# EAGLE design mainboardV1.1 (EAGLE 9.6.2)
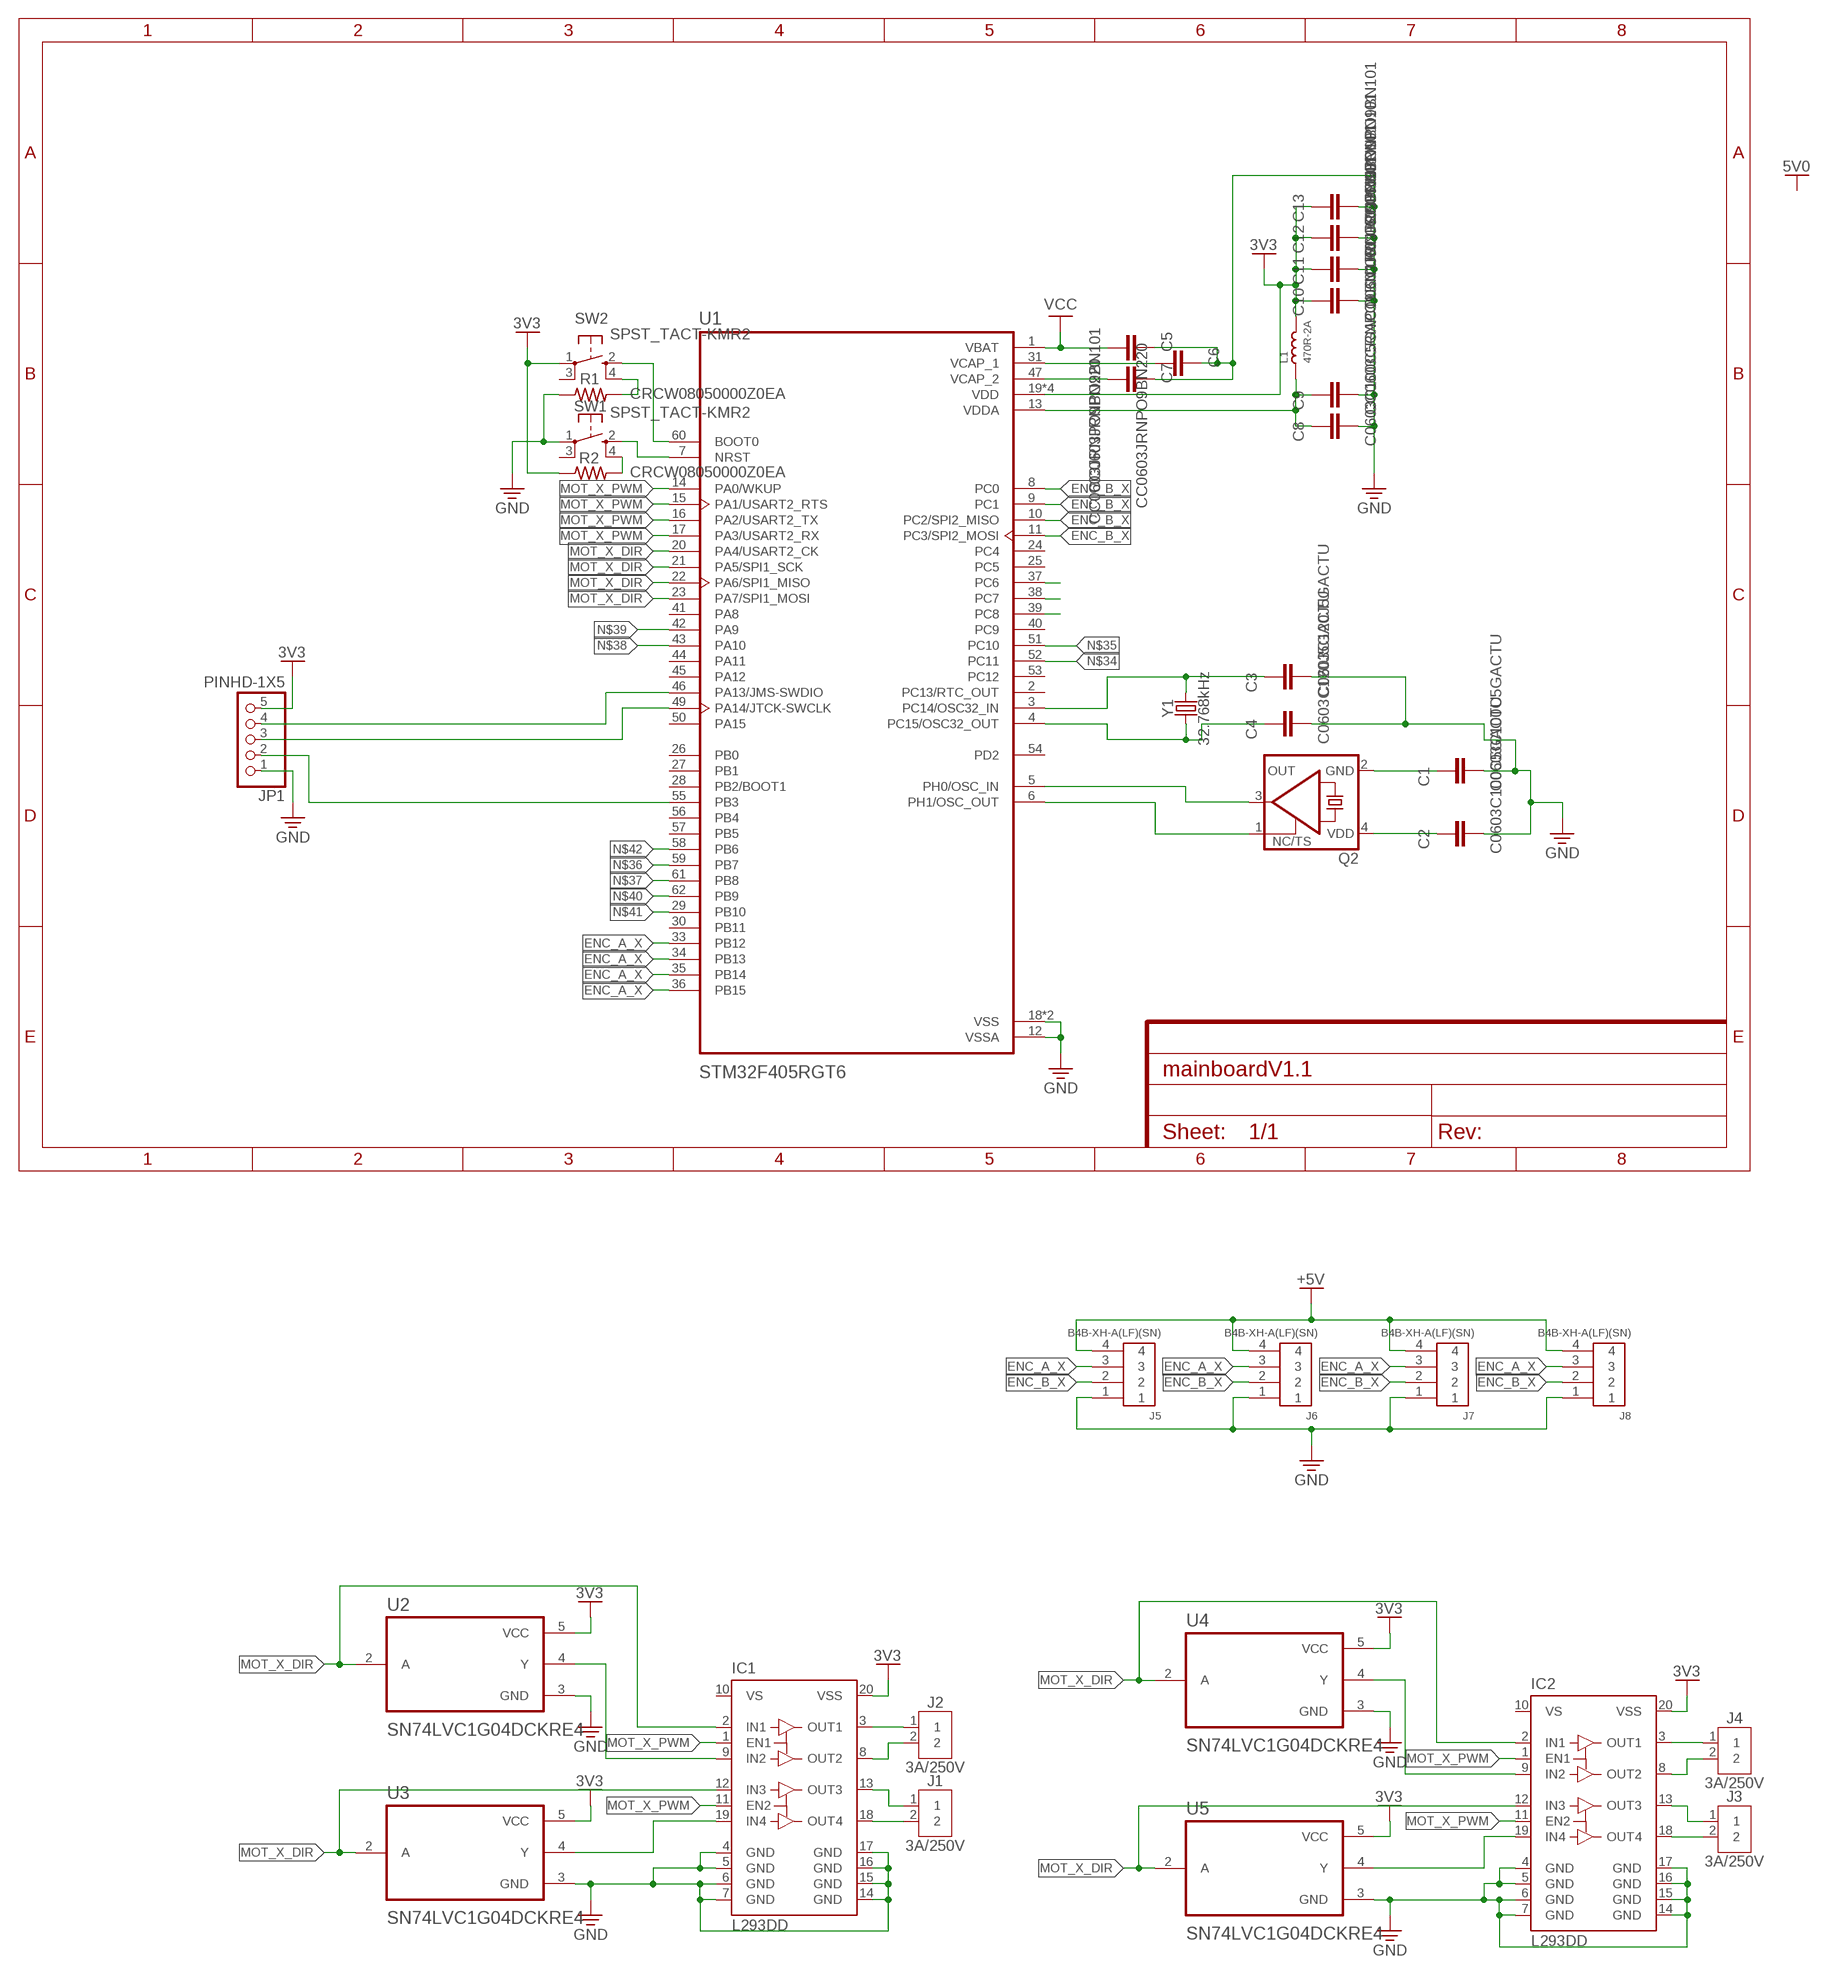
[diagram p0: schematic, sheet 1]

## Parts
C1  C0603C100C5GACTU  [CAP_0603]
C2  C0603C100C5GACTU  [CAP_0603]
C3  C0603C120J5GACTU  [CAP_0603]
C4  C0603C120J5GACTU  [CAP_0603]
C5  CC0603JRNPO9BN101  [CAP_0603]
C6  CC0603JRNPO9BN220  [CAP_0603]
C7  CC0603JRNPO9BN220  [CAP_0603]
C8  C0603C100C5GACTU  [CAP_0603]
C9  CC0603CRNPO9BN1R0  [CAP_0603]
C10  CC0603JRNPO9BN101  [CAP_0603]
C11  CC0603JRNPO9BN101  [CAP_0603]
C12  CC0603JRNPO9BN101  [CAP_0603]
C13  CC0603JRNPO9BN101  [CAP_0603]
IC1  L293DD  [SO20]
IC2  L293DD  [SO20]
J1  3A/250V  B2B-XH-A  [B2B-XH-A]
J2  3A/250V  B2B-XH-A  [B2B-XH-A]
J3  3A/250V  B2B-XH-A  [B2B-XH-A]
J4  3A/250V  B2B-XH-A  [B2B-XH-A]
J5  B4B-XH-A(LF)(SN)  [B4B-XH-A(LF)(SN)]
J6  B4B-XH-A(LF)(SN)  [B4B-XH-A(LF)(SN)]
J7  B4B-XH-A(LF)(SN)  [B4B-XH-A(LF)(SN)]
J8  B4B-XH-A(LF)(SN)  [B4B-XH-A(LF)(SN)]
JP1  PINHD-1X5  [1X05]
L1  470R-2A  SMD-FERRITE-BEAD-470R-2A(0805)'0805'  [L0805]
Q2  KXO-PXO/XO-V96  [3.2X2.5_KXO-V96]
R1  CRCW08050000Z0EA  [RES_0805]
R2  CRCW08050000Z0EA  [RES_0805]
SW1  SPST_TACT-KMR2  [KMR2]
SW2  SPST_TACT-KMR2  [KMR2]
U1  STM32F405RGT6  [QFP50P1200X1200X160-64N]
U2  SN74LVC1G04DCKRE4  [SOT65P210X110-5N]
U3  SN74LVC1G04DCKRE4  [SOT65P210X110-5N]
U4  SN74LVC1G04DCKRE4  [SOT65P210X110-5N]
U5  SN74LVC1G04DCKRE4  [SOT65P210X110-5N]
Y1  32.768kHz  CRYSTAL-32.768KHZSMD-3.2X1.5  [CRYSTAL-SMD-3.2X1.5MM]

## Nets
3V3: C10.1 C11.1 C12.1 C13.1 IC1.20(VSS) IC2.20(VSS) JP1.5 L1.2 R2.1 SW2.1(P) U1.19(VDD) U1.32(VDD) U1.48(VDD) U1.64(VDD) U2.5(VCC) U3.5(VCC) U4.5(VCC) U5.5(VCC)
+5V: J5.4 J6.4 J7.4 J8.4
ENC_A_X: J5.3 J6.3 J7.3 J8.3 U1.33(PB12) U1.34(PB13) U1.35(PB14) U1.36(PB15)
ENC_B_X: J5.2 J6.2 J7.2 J8.2 U1.8(PC0) U1.9(PC1) U1.10(PC2/SPI2_MISO) U1.11(PC3/SPI2_MOSI)
GND: C1.2 C2.2 C3.2 C4.2 C5.1 C6.1 C7.1 C8.2 C9.2 C10.2 C11.2 C12.2 C13.2 IC1.4(GND) IC1.5(GND) IC1.6(GND) IC1.7(GND) IC1.14(GND) IC1.15(GND) IC1.16(GND) IC1.17(GND) IC2.4(GND) IC2.5(GND) IC2.6(GND) IC2.7(GND) IC2.14(GND) IC2.15(GND) IC2.16(GND) IC2.17(GND) J5.1 J6.1 J7.1 J8.1 JP1.1 R1.1 SW1.1(P) U1.12(VSSA) U1.18(VSS) U1.63(VSS) U2.3(GND) U3.3(GND) U4.3(GND) U5.3(GND)
MOT_X_DIR: IC1.2(IN1) IC1.12(IN3) IC2.2(IN1) IC2.12(IN3) U1.20(PA4/USART2_CK) U1.21(PA5/SPI1_SCK) U1.22(PA6/SPI1_MISO) U1.23(PA7/SPI1_MOSI) U2.2(A) U3.2(A) U4.2(A) U5.2(A)
MOT_X_PWM: IC1.1(EN1) IC1.11(EN2) IC2.1(EN1) IC2.11(EN2) U1.14(PA0/WKUP) U1.15(PA1/USART2_RTS) U1.16(PA2/USART2_TX) U1.17(PA3/USART2_RX)
N$1: Q2.3(OUT) U1.5(PH0/OSC_IN)
N$2: Q2.1(TS) U1.6(PH1/OSC_OUT)
N$3: C4.1 U1.4(PC15/OSC32_OUT) Y1.P$1
N$4: U1.37(PC6)
N$5: JP1.4 U1.46(PA13/JMS-SWDIO)
N$6: JP1.3 U1.49(PA14/JTCK-SWCLK)
N$7: JP1.2 U1.55(PB3)
N$8: IC1.19(IN4) U3.4(Y)
N$9: C6.2 U1.31(VCAP_1)
N$10: C8.1 C9.1 L1.1 U1.13(VDDA)
N$11: SW2.2(S) U1.60(BOOT0)
N$12: SW1.2(S) U1.7(NRST)
N$13: C7.2 U1.47(VCAP_2)
N$14: R1.2 SW2.4(S1)
N$15: R2.2 SW1.4(S1)
N$16: C3.1 U1.3(PC14/OSC32_IN) Y1.P$2
N$17: C1.1 Q2.2(GND)
N$18: C2.1 Q2.4(VDD)
N$19: IC1.9(IN2) U2.4(Y)
N$20: U1.38(PC7)
N$21: U1.39(PC8)
N$34: U1.52(PC11)
N$35: U1.51(PC10)
N$36: U1.59(PB7)
N$37: U1.61(PB8)
N$38: U1.43(PA10)
N$39: U1.42(PA9)
N$40: U1.62(PB9)
N$41: U1.29(PB10)
N$42: U1.58(PB6)
N$44: IC1.13(OUT3) J1.1
N$45: IC1.18(OUT4) J1.2
N$46: IC1.8(OUT2) J2.2
N$47: IC1.3(OUT1) J2.1
N$49: IC2.19(IN4) U5.4(Y)
N$50: IC2.9(IN2) U4.4(Y)
N$54: IC2.13(OUT3) J3.1
N$55: IC2.18(OUT4) J3.2
N$56: IC2.8(OUT2) J4.2
N$57: IC2.3(OUT1) J4.1
VCC: C5.2 U1.1(VBAT)
Unconnected: SW1.3(P1) SW2.3(P1) U1.2(PC13/RTC_OUT) U1.24(PC4) U1.25(PC5) U1.26(PB0) U1.27(PB1) U1.28(PB2/BOOT1) U1.30(PB11) U1.40(PC9) U1.41(PA8) U1.44(PA11) U1.45(PA12) U1.50(PA15) U1.53(PC12) U1.54(PD2) U1.56(PB4) U1.57(PB5)

## Power pins joined to a net without a drawn wire
VS: IC1.10(VS) IC2.10(VS)

## Library data of the parts
C1 C2 C8 = Resistor_Capacitor:C0603C100C5GACTU: CAP CER 10PF 50V C0G/NP0 0603 Manufacturer's datasheet <https://content.kemet.com/datasheets/KEM_C1003_C0G_SMD.pdf>; CREATED_BY: PCBLayout.com; DIGIKEY_PART_NUMBER: 399-7814-2-ND; MANUFACTURER: KEMET; MPN: C0603C100C5GACTU; PACKAGE: SMD 0603
C3 C4 = Resistor_Capacitor:C0603C120J5GACTU: CAP CER 12PF 50V C0G/NP0 0603 Manufacturer's datasheet <https://content.kemet.com/datasheets/KEM_C1003_C0G_SMD.pdf>; CREATED_BY: PCBLayout.com; DIGIKEY_PART_NUMBER: 399-1050-2-ND; MANUFACTURER: KEMET; MPN: C0603C120J5GACTU; PACKAGE: SMD 0603
C5 C10-C13 = Resistor_Capacitor:CC0603JRNPO9BN101: CAP CER 100PF 50V C0G/NPO 0603 Manufacturer's datasheet <http://www.yageo.com/documents/recent/UPY-GP_NP0_16V-to-50V_16.pdf>; CREATED_BY: PCBLayout.com; DIGIKEY_PART_NUMBER: 311-1069-2-ND; MANUFACTURER: Yageo; MPN: CC0603JRNPO9BN101; PACKAGE: SMD 0603
C6 C7 = Resistor_Capacitor:CC0603JRNPO9BN220: CAP CER 22PF 50V C0G/NPO 0603 Manufacturer's datasheet <http://www.yageo.com/documents/recent/UPY-GP_NP0_16V-to-50V_16.pdf>; CREATED_BY: PCBLayout.com; DIGIKEY_PART_NUMBER: 311-1062-2-ND; MANUFACTURER: Yageo; MPN: CC0603JRNPO9BN220; PACKAGE: SMD 0603
C9 = Resistor_Capacitor:CC0603CRNPO9BN1R0: CAP CER 1PF 50V C0G/NPO 0603 Manufacturer's datasheet <http://www.yageo.com/documents/recent/UPY-GP_NP0_16V-to-50V_16.pdf>; CREATED_BY: PCBLayout.com; DIGIKEY_PART_NUMBER: 311-1049-2-ND; MANUFACTURER: Yageo; MPN: CC0603CRNPO9BN1R0; PACKAGE: SMD 0603
IC1 IC2 = st-microelectronics:L293DD: PUSH-PULL FOUR CHANNEL DRIVER WITH DIODES Source: http://www.st.com/stonline/books/pdf/docs/1330.pdf; OC_FARNELL: unknown
J1-J4 = Connector:B2B-XH-A: XH Connector Top Entry - 2POS Details see: Datasheet <http://www.jst-mfg.com/product/pdf/eng/eXH.pdf>; CATEGORY: CONNECTOR; DESCRIPTION: 2.5mm pitch/disconnectable crimp style connector; MANUFACTURER: JST (XH CONNECTOR); MPN: B2B-XH-A; OPERATING_TEMPERATURE: -25°C ~ 85°C; PART_STATUS: ACTIVE; ROHS_COMPLIANT: COMPLIANT; SERIES: B_B-XH-A; SUB_CATEGORY: Through hole connector; TYPE: top entry
J5-J8 = Headers:B4B-XH-A(LF)(SN): CONN HEADER VERT 4POS 2.5MM Manufacturer's datasheet <http://www.jst-mfg.com/product/pdf/eng/eXH.pdf>; CREATED_BY: PCBLayout.com; DIGIKEY_PARTNO: 455-2249-ND; MANUFACTURER: JST Sales America Inc.; MPN: B4B-XH-A(LF)(SN)
JP1 = Connector:PINHD-1X5: PIN HEADER; CATEGORY: CONNECTOR; SUB-CATEGORY: PIN-HEADER
L1 = OPL_Ferrite_and_Magnetic_Bead:SMD-FERRITE-BEAD-470R-2A(0805): 303030008; MPN: WLB2012-471T20
Q2 = crystal-geyer_V1_0:KXO-PXO/XO-V: Clock Oscillator (PXO/XO) MHz : KXO-V - Serie Model Size l/w/h [mm] Frequency Range Frequency Stability Temp. Range [°C] Output AECQ 200 availabel Datasheet KXO-V94 KXO-V94 KXO-V95 KXO-V95 KXO-V96 KXO-V96 KXO-V99 KXO-V99 KXO-97 KXO-V97 KXO-97 - KXO-V97 2.0/1.6/0.80 2.0/1.6/0.80 2.5/2.0/0.82 2.5/2.0/0.82 3.2/2.5/1.2 3.2/2.5/1.2 5.0/3.2/1.2 5.0/3.2/1.2 7.0/5.08/1.3 7.0/5.08/1.3 7.0/5.08/1.3 32,768 kHz 1,0 ~ 80,0 MHz 32,768 kHz 1,0 ~ 70,0 MHz 32,768 kHz 1,0 ~ 156,0 MHz 32,768 kHz 1,0 ~ 200,0 MHz 32,768 kHz 32,768 kHz 1,0 ~ 160,0 MHz ±25 … ±100ppm ±25 … ±100ppm ±25 … ±100ppm ±25 … ±100ppm ±25 … ±100ppm ±25 … ±100ppm ±25 … ±100ppm ±25 … ±100ppm ±25 … ±100ppm ±25 … ±100ppm ±25 … ±100ppm (*) -40°C …+85°C (*) -40°C …+85°C (*) -40°C …+85°C (*) -40°C …+85°C (*) -40°C …+85°C (*) -40°C …+85°C (*) -40°C …+85°C (*) -40°C …+85°C (*) -40°C …+85°C (*) -40°C …+85°C (*) -40°C …+85°C HCMOS HCMOS HCMOS HCMOS HCMOS HCMOS HCMOS HCMOS HCMOS HCMOS HCMOS - - yes yes yes yes - - - - - KXO-V94-kHz.pdf <http://www.geyer-electronic.de/uploads/tx_userartikelfrequenz/GEYER-KXO-V94-kHz.pdf> KXO-V94.pdf <http://www.geyer-electronic.de/uploads/tx_userartikelfrequenz/GEYER-KXO-V94.pdf> KXO-V95-kHz.pdf <http://www.geyer-electronic.de/uploads/tx_userartikelfrequenz/GEYER-KXO-V95-kHz.pdf> KXO-V95.pdf <http://www.geyer-electronic.de/uploads/tx_userartikelfrequenz/GEYER-KXO-V95.pdf> KXO-V96-kHz.pdf <http://www.geyer-electronic.de/uploads/tx_userartikelfrequenz/GEYER-KXO-V96-kHz.pdf> KXO-V96.pdf <http://www.geyer-electronic.de/uploads/tx_userartikelfrequenz/GEYER-KXO-V96.pdf> KXO-V99-kHz.pdf <http://www.geyer-electronic.de/uploads/tx_userartikelfrequenz/GEYER-KXO-V99-kHz.pdf> KXO-V99.pdf <http://www.geyer-electronic.de/uploads/tx_userartikelfrequenz/GEYER-KXO-V99.pdf> KXO-97-kHz.pdf <http://www.geyer-electronic.de/uploads/tx_userartikelfrequenz/GEYER-KXO-97-kHz.pdf> KXO-V97-kHz.pdf <http://www.geyer-electronic.de/uploads/tx_userartikelfrequenz/GEYER-KXO-V97-kHz.pdf> KXO-V97.pdf <http://www.geyer-electronic.de/uploads/tx_userartikelfrequenz/GEYER-KXO-V97.pdf> <http://www.geyer-electronic.de/fileadmin/template/img/logo-geyer-electronic.png> Details see: http://www.geyer-electronic.de/Frequenz-Produkte.9.0.html Created 2016-06-07, Hans Locher 2016 (C) Geyer Quartz Technology Hans Locher KXOV94,KXOV95;KXOV96;KXOV97;KXO97;2016;2520;3225;5032;70508;2,5x2,0;3,2x2,5;5,0x3,2;7,0x5,08;2.5x2.0;3.2x2.5;5.0x3.2;7.0x5.08;
R1 R2 = Resistor_Capacitor:CRCW08050000Z0EA: RES SMD 0 OHM JUMPER 1/8W 0805 Manufacturer's datasheet <http://www.vishay.com/docs/20035/dcrcwe3.pdf>; CREATED_BY: PCBLayout.com; DIGIKEY_PART_NUMBER: 541-0.0ATR-ND; MANUFACTURER: Vishay Dale; MPN: CRCW08050000Z0EA; PACKAGE: SMD 0805
SW1 SW2 = adafruit:SPST_TACT: SMT 6mm switch, EVQQ2 series http://www.ladyada.net/library/eagle
U1 = STM32F405RGT6:STM32F405RGT6: High-performance foundation line, ARM Cortex-M4 core with DSP and FPU, 1 Mbyte Flash, 168 MHz CPU, ART Accelerator Check availability <https://pricing.snapeda.com/parts/STM32F405RGT6/STMicroelectronics/view-part?ref=eda>; AVAILABILITY: In Stock; CHECK_PRICES: https://www.snapeda.com/parts/STM32F405RGT6/STMicroelectronics/view-part/?ref=eda; DESCRIPTION: ARM® Cortex®-M4 STM32F4 Microcontroller IC 32-Bit Single-Core 168MHz 1MB (1M x 8) FLASH 64-LQFP (10x10); MF: STMicroelectronics; MP: STM32F405RGT6; PACKAGE: LQFP-64 STMicroelectronics; PRICE: None; PURCHASE-URL: https://www.snapeda.com/api/url_track_click_mouser/?unipart_id=105502&manufacturer=STMicroelectronics&part_name=STM32F405RGT6&search_term=stm32f405rgt6; SNAPEDA_LINK: https://www.snapeda.com/parts/STM32F405RGT6/STMicroelectronics/view-part/?ref=snap
U2-U5 = SN74LVC1G04DCKRE4:SN74LVC1G04DCKRE4: Check availability <https://pricing.snapeda.com/parts/SN74LVC1G04DCKRE4/Texas%20Instruments/view-part?ref=eda>; AVAILABILITY: In Stock; CHECK_PRICES: https://www.snapeda.com/parts/SN74LVC1G04DCKRE4/Texas+Instruments/view-part/?ref=eda; DESCRIPTION: Single Inverter 5-SC70 -40 to 125; MF: Texas Instruments; MP: SN74LVC1G04DCKRE4; PACKAGE: SC70-5 Texas Instruments; PRICE: None; PURCHASE-URL: https://www.snapeda.com/api/url_track_click_mouser/?unipart_id=1206589&manufacturer=Texas Instruments&part_name=SN74LVC1G04DCKRE4&search_term=sn74lvc1g04dckr; SNAPEDA_LINK: https://www.snapeda.com/parts/SN74LVC1G04DCKRE4/Texas+Instruments/view-part/?ref=snap
Y1 = SparkFun-Clocks:CRYSTAL-32.768KHZ: 32.768kHz Crystal Frequency: 32.768kHz Frequency Stability: ±20ppm Load Capacitance: 12.5pF (PTH-2X6 & SMD-3.2X1.5), 6pF (SMD-2X6) SparkFun Products: SparkFun BigTime Watch Kit <https://www.sparkfun.com/products/11734> SparkFun nRF52832 Breakout <https://www.sparkfun.com/products/13990> SparkFun Real Time Clock Module <https://www.sparkfun.com/products/12708>; PROD_ID: XTAL-13062

## Board
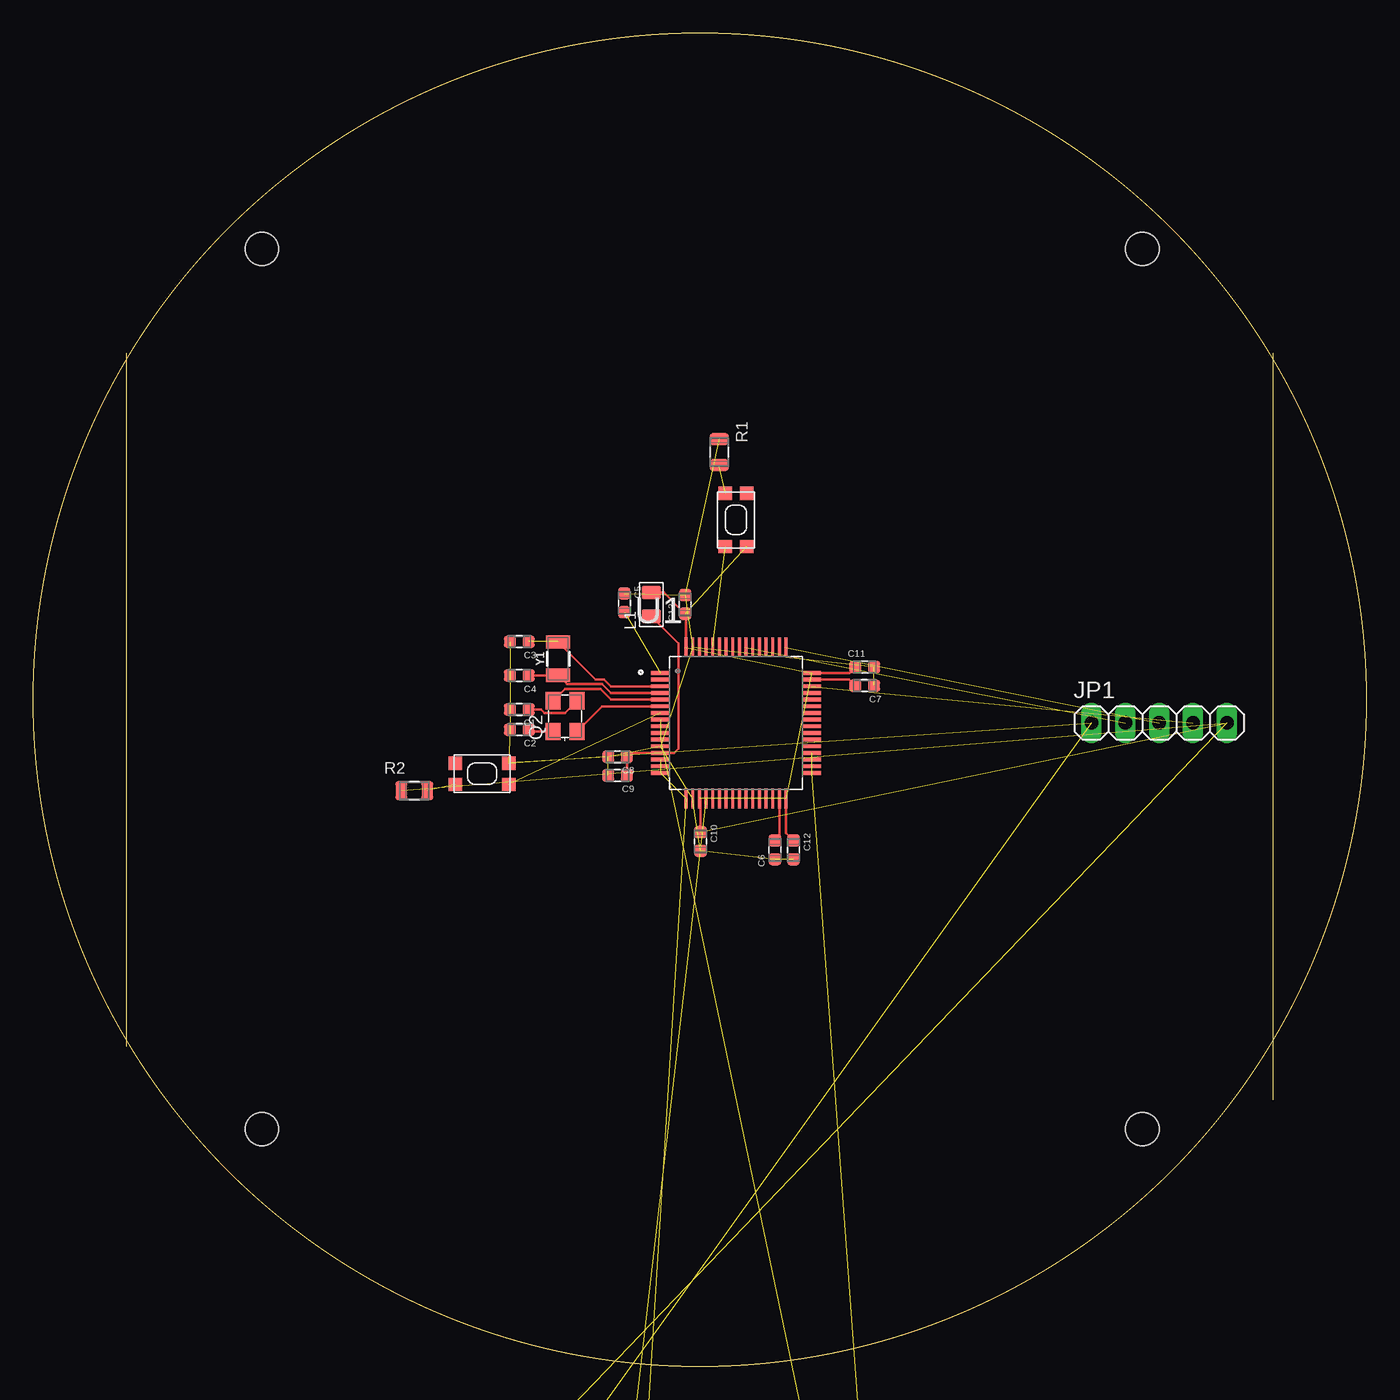
[diagram p1: board, top side]

Size 100 x 100 mm. Coordinates in mm from the lower left corner, seen from the top.
Outline: 7,24 7,76
Outline: 93,76 93,20
Outline: circle at 50,50 radius 50
Copper layers (1*16): Top 0.035mm / dielectric 1.5mm / Bottom 0.035mm
Design rules "default": minimum track width 6mil, minimum drill 0.35mm, track to track 6mil, track to pad 6mil, pad to pad 6mil, via to via 6mil, smd to smd 6mil, copper to edge 40mil, drill to drill 6mil, minimum pad ring 10mil, minimum via ring 8mil, stop-mask expansion 4mil, vias tented up to drill 0mil, thermal gap 10mil
Holes 2.5 mm at 17.16,17.78 83.2,17.78 83.2,83.82 17.16,83.82

### Footprints (pad centres in the part's own frame; a part is rotated, then mirrored left to right if it is on the bottom)
CAP_0603 = smd 0.92 x 0.93: 1 -0.705,0; 2 0.705,0
SO20 = smd 0.6 x 2.2: 1 -5.715,-4.6; 2 -4.445,-4.6; 3 -3.175,-4.6; 4 -1.905,-4.6; 5 -0.635,-4.6; 6 0.635,-4.6; 7 1.905,-4.6; 8 3.175,-4.6; 9 4.445,-4.6; 10 5.715,-4.6; 11 5.715,4.6; 12 4.445,4.6; 13 3.175,4.6; 14 1.905,4.6; 15 0.635,4.6; 16 -0.635,4.6; 17 -1.905,4.6; 18 -3.175,4.6; 19 -4.445,4.6; 20 -5.715,4.6
B2B-XH-A = drill 0.64: 1 0,0; 2 2.5,0
B4B-XH-A(LF)(SN) = drill 0.9 square: 1 -3.75,0 | drill 0.9: 2 -1.25,0; 3 1.25,0; 4 3.75,0
1X05 = drill 1.016 long: 1 -5.08,0; 2 -2.54,0; 3 0,0; 4 2.54,0; 5 5.08,0
L0805 = smd 1.016 x 1.397: 1 -0.889,0; 2 0.889,0
3.2X2.5_KXO-V96 = smd 1.3 x 1.1: 1 -1.15,-0.9; 2 1.15,-0.9; 3 1.15,0.9; 4 -1.15,0.9
RES_0805 = smd 0.87 x 1.42: 1 -0.975,0; 2 0.975,0
KMR2 = smd 1 x 1: 1 2,0.8; 2 2,-0.8; 3 -2,0.8; 4 -2,-0.8
QFP50P1200X1200X160-64N = smd 1.47 x 0.28: 1 -5.67,3.75; 2 -5.67,3.25; 3 -5.67,2.75; 4 -5.67,2.25; 5 -5.67,1.75; 6 -5.67,1.25; 7 -5.67,0.75; 8 -5.67,0.25; 9 -5.67,-0.25; 10 -5.67,-0.75; 11 -5.67,-1.25; 12 -5.67,-1.75; 13 -5.67,-2.25; 14 -5.67,-2.75; 15 -5.67,-3.25; 16 -5.67,-3.75; 33 5.67,-3.75; 34 5.67,-3.25; 35 5.67,-2.75; 36 5.67,-2.25; 37 5.67,-1.75; 38 5.67,-1.25; 39 5.67,-0.75; 40 5.67,-0.25; 41 5.67,0.25; 42 5.67,0.75; 43 5.67,1.25; 44 5.67,1.75; 45 5.67,2.25; 46 5.67,2.75; 47 5.67,3.25; 48 5.67,3.75 | smd 0.28 x 1.47: 17 -3.75,-5.67; 18 -3.25,-5.67; 19 -2.75,-5.67; 20 -2.25,-5.67; 21 -1.75,-5.67; 22 -1.25,-5.67; 23 -0.75,-5.67; 24 -0.25,-5.67; 25 0.25,-5.67; 26 0.75,-5.67; 27 1.25,-5.67; 28 1.75,-5.67; 29 2.25,-5.67; 30 2.75,-5.67; 31 3.25,-5.67; 32 3.75,-5.67; 49 3.75,5.67; 50 3.25,5.67; 51 2.75,5.67; 52 2.25,5.67; 53 1.75,5.67; 54 1.25,5.67; 55 0.75,5.67; 56 0.25,5.67; 57 -0.25,5.67; 58 -0.75,5.67; 59 -1.25,5.67; 60 -1.75,5.67; 61 -2.25,5.67; 62 -2.75,5.67; 63 -3.25,5.67; 64 -3.75,5.67
SOT65P210X110-5N = smd 1.19 x 0.4: 1 -0.96,0.65; 2 -0.96,0; 3 -0.96,-0.65; 4 0.96,-0.65; 5 0.96,0.65
CRYSTAL-SMD-3.2X1.5MM = smd 1 x 1.8: P$1 -1.25,0; P$2 1.25,0

### Placement (x,y rotation side)
C1  36.46,49.28 180 top
C2  36.46,47.75 180 top
C3  36.46,54.36 180 top
C4  36.46,51.82 180 top
C5  44.34,57.28 270 top
C6  55.64,38.73 90 top
C7  62.37,51.05 180 top
C8  43.83,45.72 180 top
C9  43.83,44.32 180 top
C10  50.05,39.37 270 top
C11  62.37,52.45 0 top
C12  57.04,38.73 270 top
C13  48.91,57.15 90 top
IC1  40.02,-13.97 0 top  (outside the outline)
IC2  41.29,-36.83 0 top  (outside the outline)
J1  43.83,-24.13 0 top  (outside the outline)
J2  36.21,-24.13 0 top  (outside the outline)
J3  36.21,-48.26 0 top  (outside the outline)
J4  43.83,-48.26 0 top  (outside the outline)
J5  61.61,-16.51 0 top  (outside the outline)
J6  61.61,-29.21 0 top  (outside the outline)
J7  61.61,-41.91 0 top  (outside the outline)
J8  61.61,-54.61 0 top  (outside the outline)
JP1  84.47,48.26 0 top
L1  46.37,57.15 90 top
Q2  39.89,48.77 90 top
R1  51.45,68.58 270 top
R2  28.59,43.18 0 top
SW1  33.67,44.45 0 top
SW2  52.72,63.5 270 top
U1  52.72,48.26 0 top
U2  51.45,-21.59 0 top  (outside the outline)
U3  51.45,-27.94 0 top  (outside the outline)
U4  36.21,-57.15 0 top  (outside the outline)
U5  36.21,-63.5 0 top  (outside the outline)
Y1  39.38,53.09 90 top

### Tracks (layer width: path | path; a pad name or v marks a point on that pad's centre or on a via)
3V3  (12 unrouted)
  Top 0.203: U1.19 50.05,42.51 C10.1 | U1.32 56.47,40.01 C12.1 | C11.1 61.23,52.01 U1.48 | U1.64 48.97,56.39 C13.1 47.32,58.04 L1.2
+5V  (3 unrouted)
ENC_A_X  (7 unrouted)
ENC_B_X  (7 unrouted)
GND  (42 unrouted)
MOT_X_DIR  (11 unrouted)
MOT_X_PWM  (7 unrouted)
N$1
  Top 0.203: U1.5 43.35,50.01 42.54,50.82 39.9,50.82 Q2.3
N$2
  Top 0.203: Q2.1 42.69,49.51 U1.6
N$3
  Top 0.203: C4.1 37.19,51.84 Y1.P$1 40.04,51.18 42.69,51.18 43.35,50.51 U1.4
N$5  (1 unrouted)
N$6  (1 unrouted)
N$7  (1 unrouted)
N$8  (1 unrouted)
N$9
  Top 0.203: U1.31 55.97,39.77 C6.2
N$10
  Top 0.203: C9.1 C8.1 44.83,46.01 U1.13 48.06,46.01 48.4,46.36 48.4,54.23 L1.1
N$11  (1 unrouted)
N$12  (1 unrouted)
N$13
  Top 0.203: C7.2 61.21,51.51 U1.47
N$14  (1 unrouted)
N$15  (1 unrouted)
N$16  (1 unrouted)
  Top 0.203: 39.37,54.36 Y1.P$2 42.19,51.53 42.83,51.53 43.36,51.01 U1.3
N$17
  Top 0.203: C1.1 38.08,49.28 38.34,49.01 39.89,49.01 Q2.2
N$18
  Top 0.203: Q2.4 37.3,47.62 C2.1
N$19  (1 unrouted)
N$44  (1 unrouted)
N$45  (1 unrouted)
N$46  (1 unrouted)
N$47  (1 unrouted)
N$49  (1 unrouted)
N$50  (1 unrouted)
N$54  (1 unrouted)
N$55  (1 unrouted)
N$56  (1 unrouted)
N$57  (1 unrouted)
VCC  (1 unrouted)
VS  (1 unrouted)